# EAGLE design Lumen-LED-X2 (EAGLE 7.4.0)
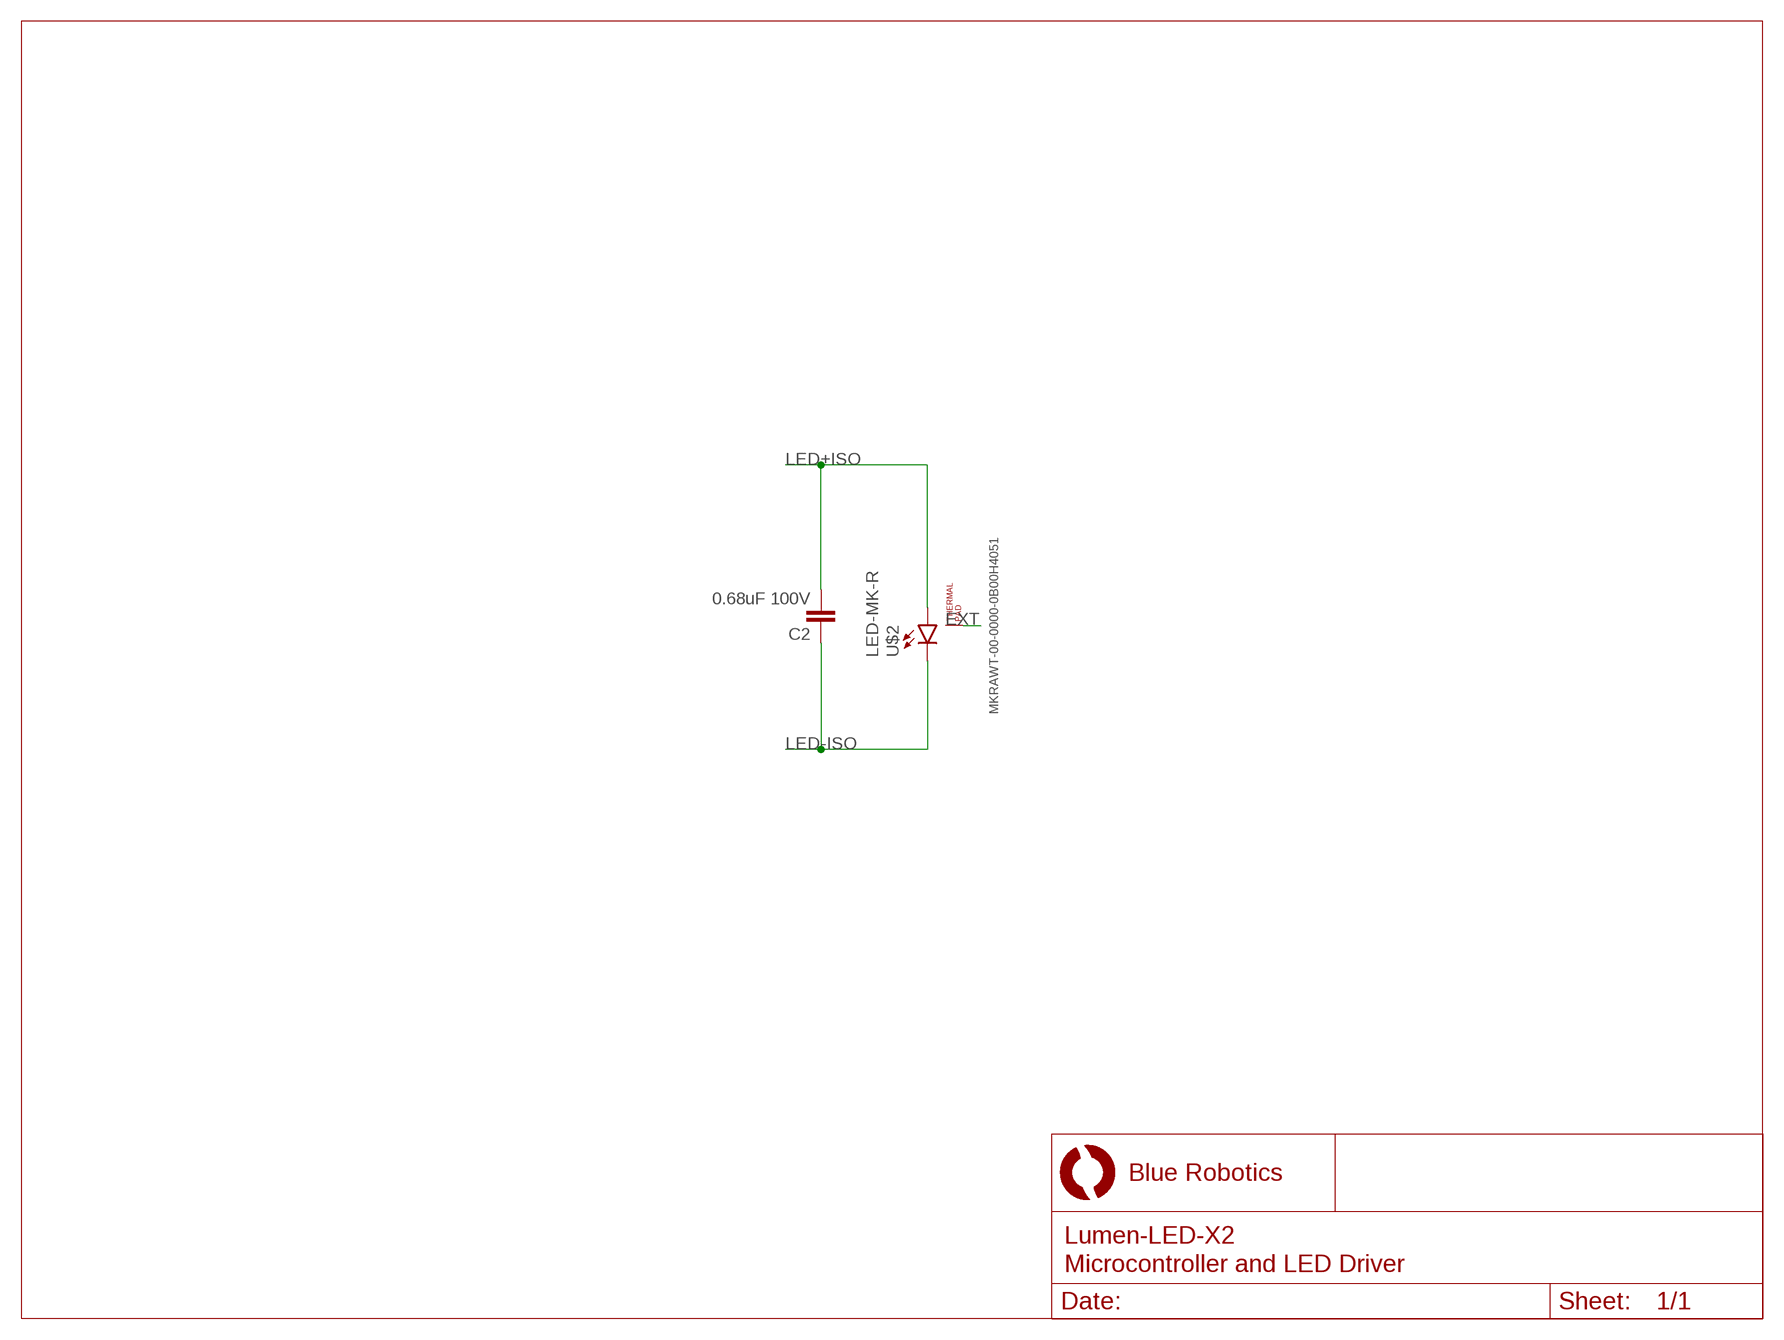
[diagram p0: schematic, sheet 1]

## Parts
C2  0.68uF 100V  C-EUC0805  [C0805]
U$2  LED-MK-R  [MK-R]

## Nets
EXT: U$2.EXP(THERMAL)
LED+ISO: C2.2 U$2.A
LED-ISO: C2.1 U$2.C

## Notes on the sheet
- MKRAWT-00-0000-0B00H4051

## Library data of the parts
C2 = resistor:C-EU: CAPACITOR, European symbol
U$2 = BlueRobotics-Main:LED-MK-R

## Board
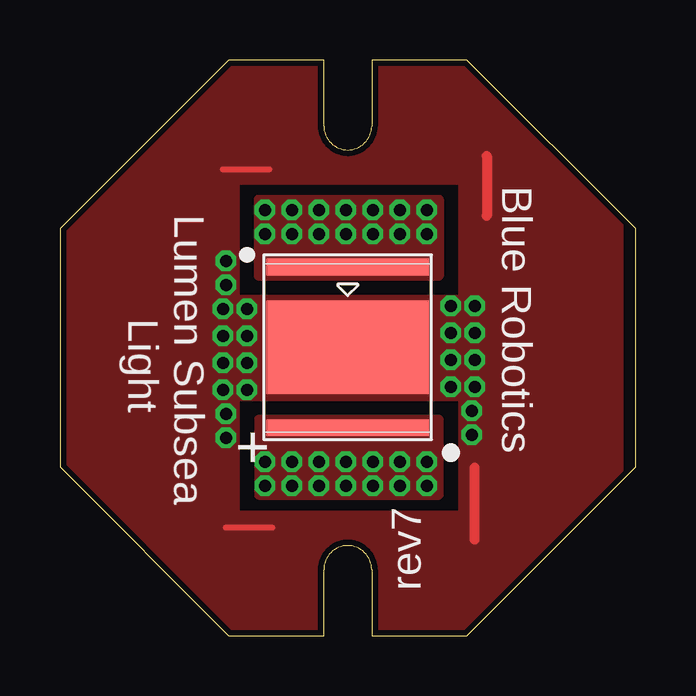
[diagram p1: board, top side]
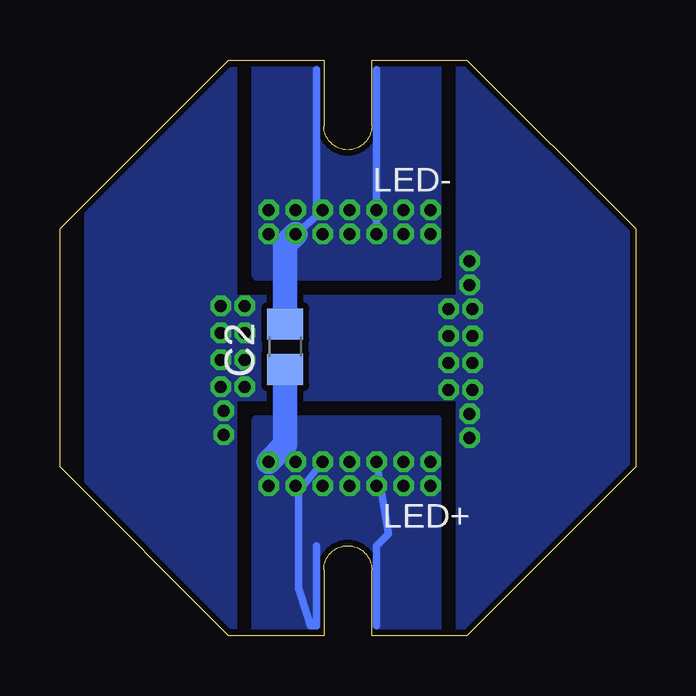
[diagram p2: board, bottom side, seen from below]

Size 24 x 24 mm. Coordinates in mm from the lower left corner, seen from the top.
Outline: 7.03,0 11,0 11,2.75 arc-180 13,2.75 13,0 16.97,0 24,7.03 24,16.97 16.97,24 13,24 13,21.25 arc-180 11,21.25 11,24 7.03,24 0,16.97 0,7.03 7.03,0
Copper layers (1*16): Top 0.0356mm / dielectric 1.5011mm / Bottom 0.0356mm
Design rules "OSHPark *": minimum track width 6mil, minimum drill 10mil, track to track 6mil, track to pad 6mil, pad to pad 6mil, via to via 6mil, smd to smd 6mil, copper to edge 6mil, drill to drill 6mil, minimum pad ring 7mil, minimum via ring 7mil, stop-mask expansion 3mil, vias tented up to drill 30mil, thermal gap 10mil

### Footprints (pad centres in the part's own frame; a part is rotated, then mirrored left to right if it is on the bottom)
C0805 = smd 1.3 x 1.5: 1 -0.95,0; 2 0.95,0
MK-R = smd 0.7 x 6.76: A 0,0; C 6.7,0 | smd 3.9 x 6.76: EXP 3.35,0

### Placement (x,y rotation side)
C2  14.61,12.04 90 bottom
U$2  12,15.37 270 top

### Tracks (layer width: path | path; a pad name or v marks a point on that pad's centre or on a via)
EXT  (via drill 0.5)
  Top 0.254: 8.86,4.5 6.92,4.5 | 8.74,19.44 6.8,19.44
  Top 0.406: 17.8,20 17.8,17.5 | 17.3,4 17.3,7
  other vias: 16.3,10.38 16.3,11.5 16.3,12.62 7.8,13.62 7.8,12.5 7.8,11.38 16.3,13.75 7.8,10.25 17.3,10.38 17.3,11.5 17.3,12.62 17.3,13.75 6.8,13.62 6.8,12.5 6.8,11.38 6.8,10.25 6.92,9.25 6.92,8.25 6.92,14.62 6.92,15.62 17.18,9.38 17.18,8.38
  pour Top (isolate 0.254, no thermals): 23.3,24 16.8,24 16.8,14 7.3,14 7.3,24 -1.2,24 -1.2,-1 7.3,-1 7.3,10 16.8,10 16.8,-1 23.3,-1
  pour Top (isolate 0.254, no thermals): 18.8,19 3.8,19 3.8,24 18.8,24
  pour Top (isolate 0.254, no thermals): 18.8,5 3.8,5 3.8,0 18.8,0
  pour Bottom (isolate 0.254, no thermals): 22.8,-1 16.8,-1 16.8,10 7.3,10 7.3,-1 -1.2,-1 -1.2,24 7.3,24 7.3,14 16.8,14 16.8,24 22.8,24
LED+ISO  (via drill 0.5)
  Bottom 0.305: 10.8,23.6 v10.8,16.75 | 13.3,23.6 13.3,17.5 v14.18,16.75
  Bottom 1.016: C2.2 14.61,16.32 v14.18,16.75
  other vias: 15.3,16.75 13.05,16.75 11.93,16.75 9.68,16.75 8.55,16.75 15.3,17.75 14.18,17.75 13.05,17.75 11.93,17.75 10.8,17.75 9.68,17.75 8.55,17.75
  pour Top (isolate 0.254, no thermals): 15.8,15 8.3,15 8.3,18.19 15.8,18.19
  pour Bottom (isolate 0.254, no thermals): 15.8,23.75 8.3,23.75 8.3,15 15.8,15
LED-ISO  (via drill 0.5)
  Bottom 0.305: 13.3,3.75 13.3,0.4 13.55,0.4 14.05,2 14.05,6 v13.05,7.25 | 10.8,0.4 10.8,3.75 10.3,4.25 v10.8,7.25
  Bottom 1.016: C2.1 14.61,7.94 v15.3,7.25
  other vias: 14.18,7.25 11.93,7.25 9.68,7.25 8.55,7.25 8.55,6.25 9.68,6.25 10.8,6.25 11.93,6.25 13.05,6.25 14.18,6.25 15.3,6.25
  pour Top (isolate 0.254, no thermals): 15.8,9 8.3,9 8.3,5.88 15.8,5.88
  pour Bottom (isolate 0.254, no thermals): 8.3,9 8.3,-1 15.8,-1 15.8,9

### Text on the board
tPlace: Blue Robotics | Lumen Subsea / Light | + | rev7
bPlace: LED- | LED+